# Altium project PCB_Project.PrjPcb
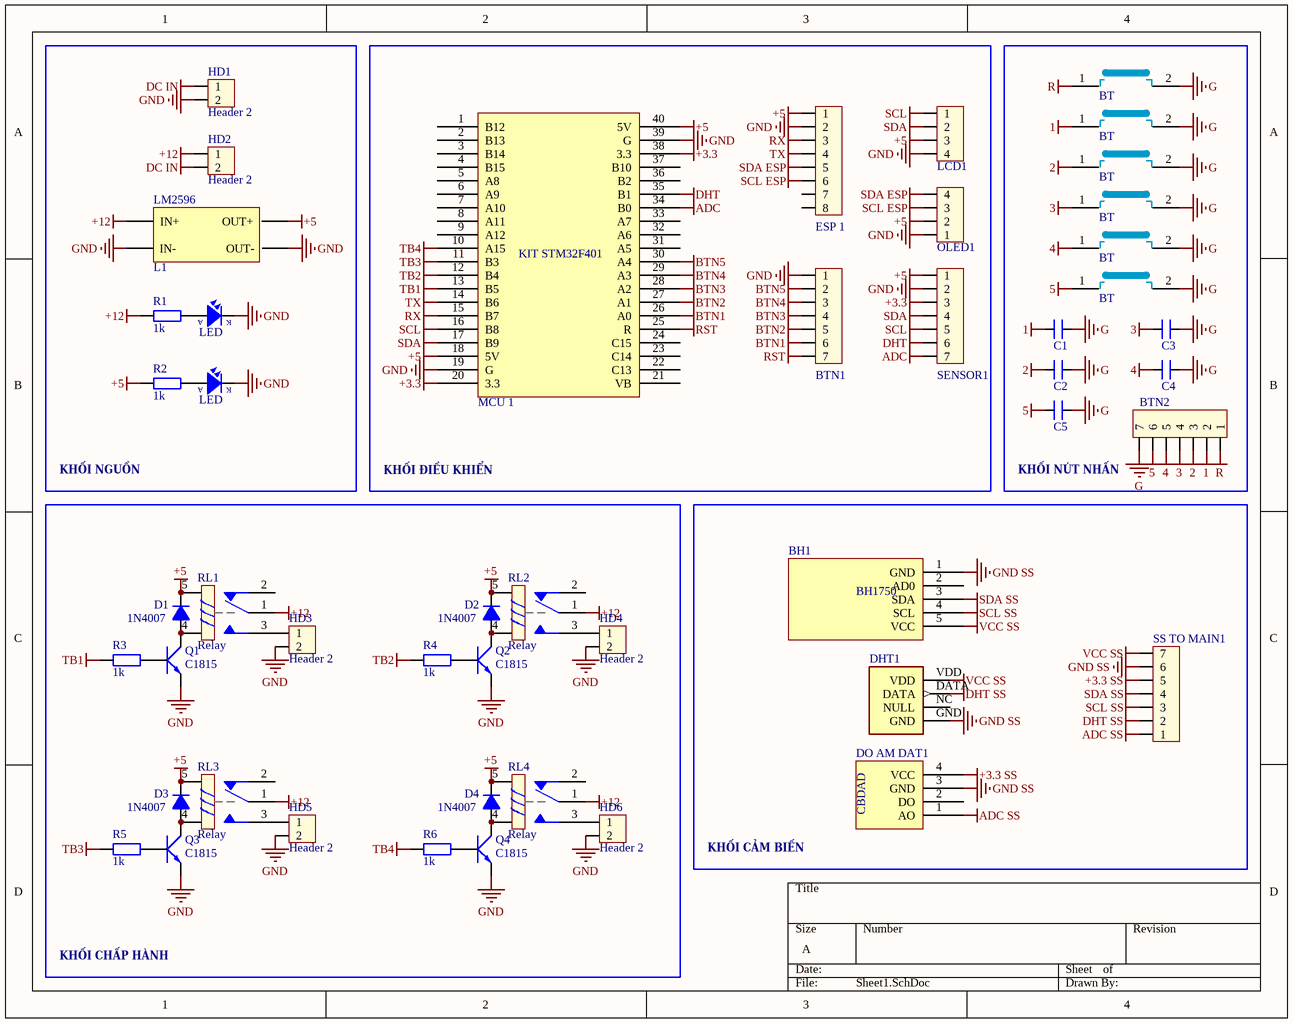
[diagram p0: Sheet1.SchDoc]
1 sheet, 49 parts. Net scope: global (net labels, ports and power ports of the same name join across sheets).
Board file: PCB1.PcbDoc

## Sheet Sheet1.SchDoc
size A; SheetNumber: 1; SheetTotal: 1

### Parts
BH1  BH1750  [BH1750]  (value not drawn)
BT1  BT  [SW4]
BT2  BT  [SW4]
BT3  BT  [SW4]
BT4  BT  [SW4]
BT5  BT  [SW4]
BT6  BT  [SW4]
BTN1  JP7  [CON7]  (value not drawn)
BTN2  JP7  [CON7]  (value not drawn)
C1  CAP gom  [CN1]  (value not drawn)
C2  CAP gom  [CN1]  (value not drawn)
C3  CAP gom  [CN1]  (value not drawn)
C4  CAP gom  [CN1]  (value not drawn)
C5  CAP gom  [CN1]  (value not drawn)
D1  1N4007  [D2A]
D2  1N4007  [D2A]
D3  1N4007  [D2A]
D4  1N4007  [D2A]
DHT1  DHT22  [DHT22]  (value not drawn)
DO_AM_DAT1  Cam_bien_do_am_dat  [Am dat]  (value not drawn)
ESP_1  JP8  [HDR1X8]  (value not drawn)
HD1  Header 2  [HED2]
HD2  Header 2  [HED2]
HD3  Header 2  [HED2]
HD4  Header 2  [HED2]
HD5  Header 2  [HED2]
HD6  Header 2  [HED2]
L1  BUCK_LM2596  [BUCK_LM2596]  (value not drawn)
LCD1  JP4  [CON4]  (value not drawn)
LED1  LED  [LED-3]
LED2  LED  [LED-3]
MCU_1  KIT STM32F401  [KIT STM32F401]  (value not drawn)
OLED1  JP4  [CON4]  (value not drawn)
Q1  C1815  [QTO-92]
Q2  C1815  [QTO-92]
Q3  C1815  [QTO-92]
Q4  C1815  [QTO-92]
R1  1k  [R1/2W]
R2  1k  [R1/2W]
R3  1k  [R1/2W]
R4  1k  [R1/2W]
R5  1k  [R1/2W]
R6  1k  [R1/2W]
RL1  Relay  [RL_SPDT_10A]
RL2  Relay  [RL_SPDT_10A]
RL3  Relay  [RL_SPDT_10A]
RL4  Relay  [RL_SPDT_10A]
SENSOR1  JP7  [CON7]  (value not drawn)
SS_TO_MAIN1  (no value)  [CON7]

### Blocks framed on the sheet
KHỐI NGUỒN: HD1 HD2 L1 LED1 LED2 R1 R2
KHỐI ĐIỀU KHIỂN: BTN1 ESP_1 LCD1 MCU_1 OLED1 SENSOR1
KHỐI NÚT NHẤN: BT1-BT6 BTN2 C1-C5
KHỐI CHẤP HÀNH: D1-D4 HD3-HD6 Q1-Q4 R3-R6 RL1-RL4
KHỐI CẢM BIẾN: BH1 DHT1 DO_AM_DAT1 SS_TO_MAIN1

### Nets
1: BT2.1 BTN2.2 C1.2
2: BT3.1 BTN2.3 C2.2
3: BT4.1 BTN2.4 C3.2
4: BT5.1 BTN2.5 C4.2
5: BT6.1 BTN2.6 C5.2
+3.3: MCU_1.20(3.3) MCU_1.38(3.3) SENSOR1.3
+3.3 SS: DO_AM_DAT1.4(VCC) SS_TO_MAIN1.5
+5: D1.2(K) D2.2(K) D3.2(K) D4.2(K) ESP_1.1 L1.4(OUT+) LCD1.3 MCU_1.18(5V) MCU_1.40(5V) OLED1.2 R2.2 RL1.5 RL2.5 RL3.5 RL4.5 SENSOR1.1
+12: HD2.1 L1.1(IN+) R1.2 RL1.1 RL2.1 RL3.1 RL4.1
ADC: MCU_1.34(B0) SENSOR1.7
ADC SS: DO_AM_DAT1.1(AO) SS_TO_MAIN1.1
BTN1: BTN1.6 MCU_1.26(A0)
BTN2: BTN1.5 MCU_1.27(A1)
BTN3: BTN1.4 MCU_1.28(A2)
BTN4: BTN1.3 MCU_1.29(A3)
BTN5: BTN1.2 MCU_1.30(A4)
DC IN: HD1.1 HD2.2
DHT: MCU_1.35(B1) SENSOR1.6
DHT SS: DHT1.DATA SS_TO_MAIN1.2
G: BT1.2 BT2.2 BT3.2 BT4.2 BT5.2 BT6.2 BTN2.7 C1.1 C2.1 C3.1 C4.1 C5.1
GND: BTN1.1 ESP_1.2 HD1.2 HD3.2 HD4.2 HD5.2 HD6.2 L1.2(IN-) L1.3(OUT-) LCD1.4 LED1.2(K) LED2.2(K) MCU_1.19(G) MCU_1.39(G) OLED1.1 Q1.1(E) Q2.1(E) Q3.1(E) Q4.1(E) SENSOR1.2
GND SS: BH1.1(GND) DHT1.GND DO_AM_DAT1.3(GND) SS_TO_MAIN1.6
R: BT1.1 BTN2.1
RST: BTN1.7 MCU_1.25(R)
RX: ESP_1.3 MCU_1.15(B7)
SCL: LCD1.1 MCU_1.16(B8) SENSOR1.5
SCL ESP: ESP_1.6 OLED1.3
SCL SS: BH1.4(SCL) SS_TO_MAIN1.3
SDA: LCD1.2 MCU_1.17(B9) SENSOR1.4
SDA ESP: ESP_1.5 OLED1.4
SDA SS: BH1.3(SDA) SS_TO_MAIN1.4
TB1: MCU_1.13(B5) R3.2
TB2: MCU_1.12(B4) R4.2
TB3: MCU_1.11(B3) R5.2
TB4: MCU_1.10(A15) R6.2
TX: ESP_1.4 MCU_1.14(B6)
VCC SS: BH1.5(VCC) DHT1.VDD SS_TO_MAIN1.7
NetD1_1: D1.1(A) Q1.2(C) RL1.4
NetD2_1: D2.1(A) Q2.2(C) RL2.4
NetD3_1: D3.1(A) Q3.2(C) RL3.4
NetD4_1: D4.1(A) Q4.2(C) RL4.4
NetHD3_1: HD3.1 RL1.3
NetHD4_1: HD4.1 RL2.3
NetHD5_1: HD5.1 RL3.3
NetHD6_1: HD6.1 RL4.3
NetLED1_1: LED1.1(A) R1.1
NetLED2_1: LED2.1(A) R2.1
NetQ1_3: Q1.3(B) R3.1
NetQ2_3: Q2.3(B) R4.1
NetQ3_3: Q3.3(B) R5.1
NetQ4_3: Q4.3(B) R6.1

Not connected (* = marked no-connect by the designer): BH1 2(AD0); DHT1 NC(NULL); DO_AM_DAT1 2(DO); ESP_1 7 8; MCU_1 1(B12) 2(B13) 3(B14) 4(B15) 5(A8) 6(A9) 7(A10) 8(A11) 9(A12) 21(VB) 22(C13) 23(C14) 24(C15) 31(A5) 32(A6) 33(A7) 36(B2) 37(B10); RL1 2; RL2 2; RL3 2; RL4 2

### Notes on the sheet
- (in symbol BUCK_LM2596) LM2596
- (in symbol Cam_bien_do_am_dat) CBDAD

### Library data of the parts
BT1-BT6 = BUTTON
BTN1 BTN2 SENSOR1 SS_TO_MAIN1 = Con7: Connector 7; Value: Connector 7
D1-D4 = D1A: Diode 1A; Value: 1N4007
DHT1 = DHT22: Capacitive-type humidity and temperature module/sensor; MF: Aosong Electronics; SnapEDA_Link: https://www.snapeda.com/parts/DHT22/Aosong+Electronics/view-part/?ref=snap; Package: Package; Value: *; MP: DHT22; Check_prices: https://www.snapeda.com/parts/DHT22/Aosong+Electronics/view-part/?ref=eda
ESP_1 = jam 8: Value: Connector 8
HD1-HD6 = Hed2: Header 2 (Green); Value: Header 2
LCD1 OLED1 = Con4: Connector 4; Value: Connector 4
LED1 LED2 = LED: LED Single colour Green and Red; Value: LED 3 ly Single Colour
Q1-Q4 = C1815: NPN 600mW, ECB; Value: C1815
R1-R6 = R1/4W: Resistor 1/4W; Value: R1/4W - 1K
RL1-RL4 = Relay SRD: Relay SPDT 5 Pin; Value: Relay SPDT, 10A, 12V